# EasyEDA Pro project MIC01.eprj

# Schematic 主控板
Board Name: 主控; Create Date: 2024-11-15; Page Name: P1; Project Name: MIC01; Schematic Name: Schematic1; Update Date: 2024-11-18; Company: 嘉立创EDA; Page Size: A4; Version: V1.0
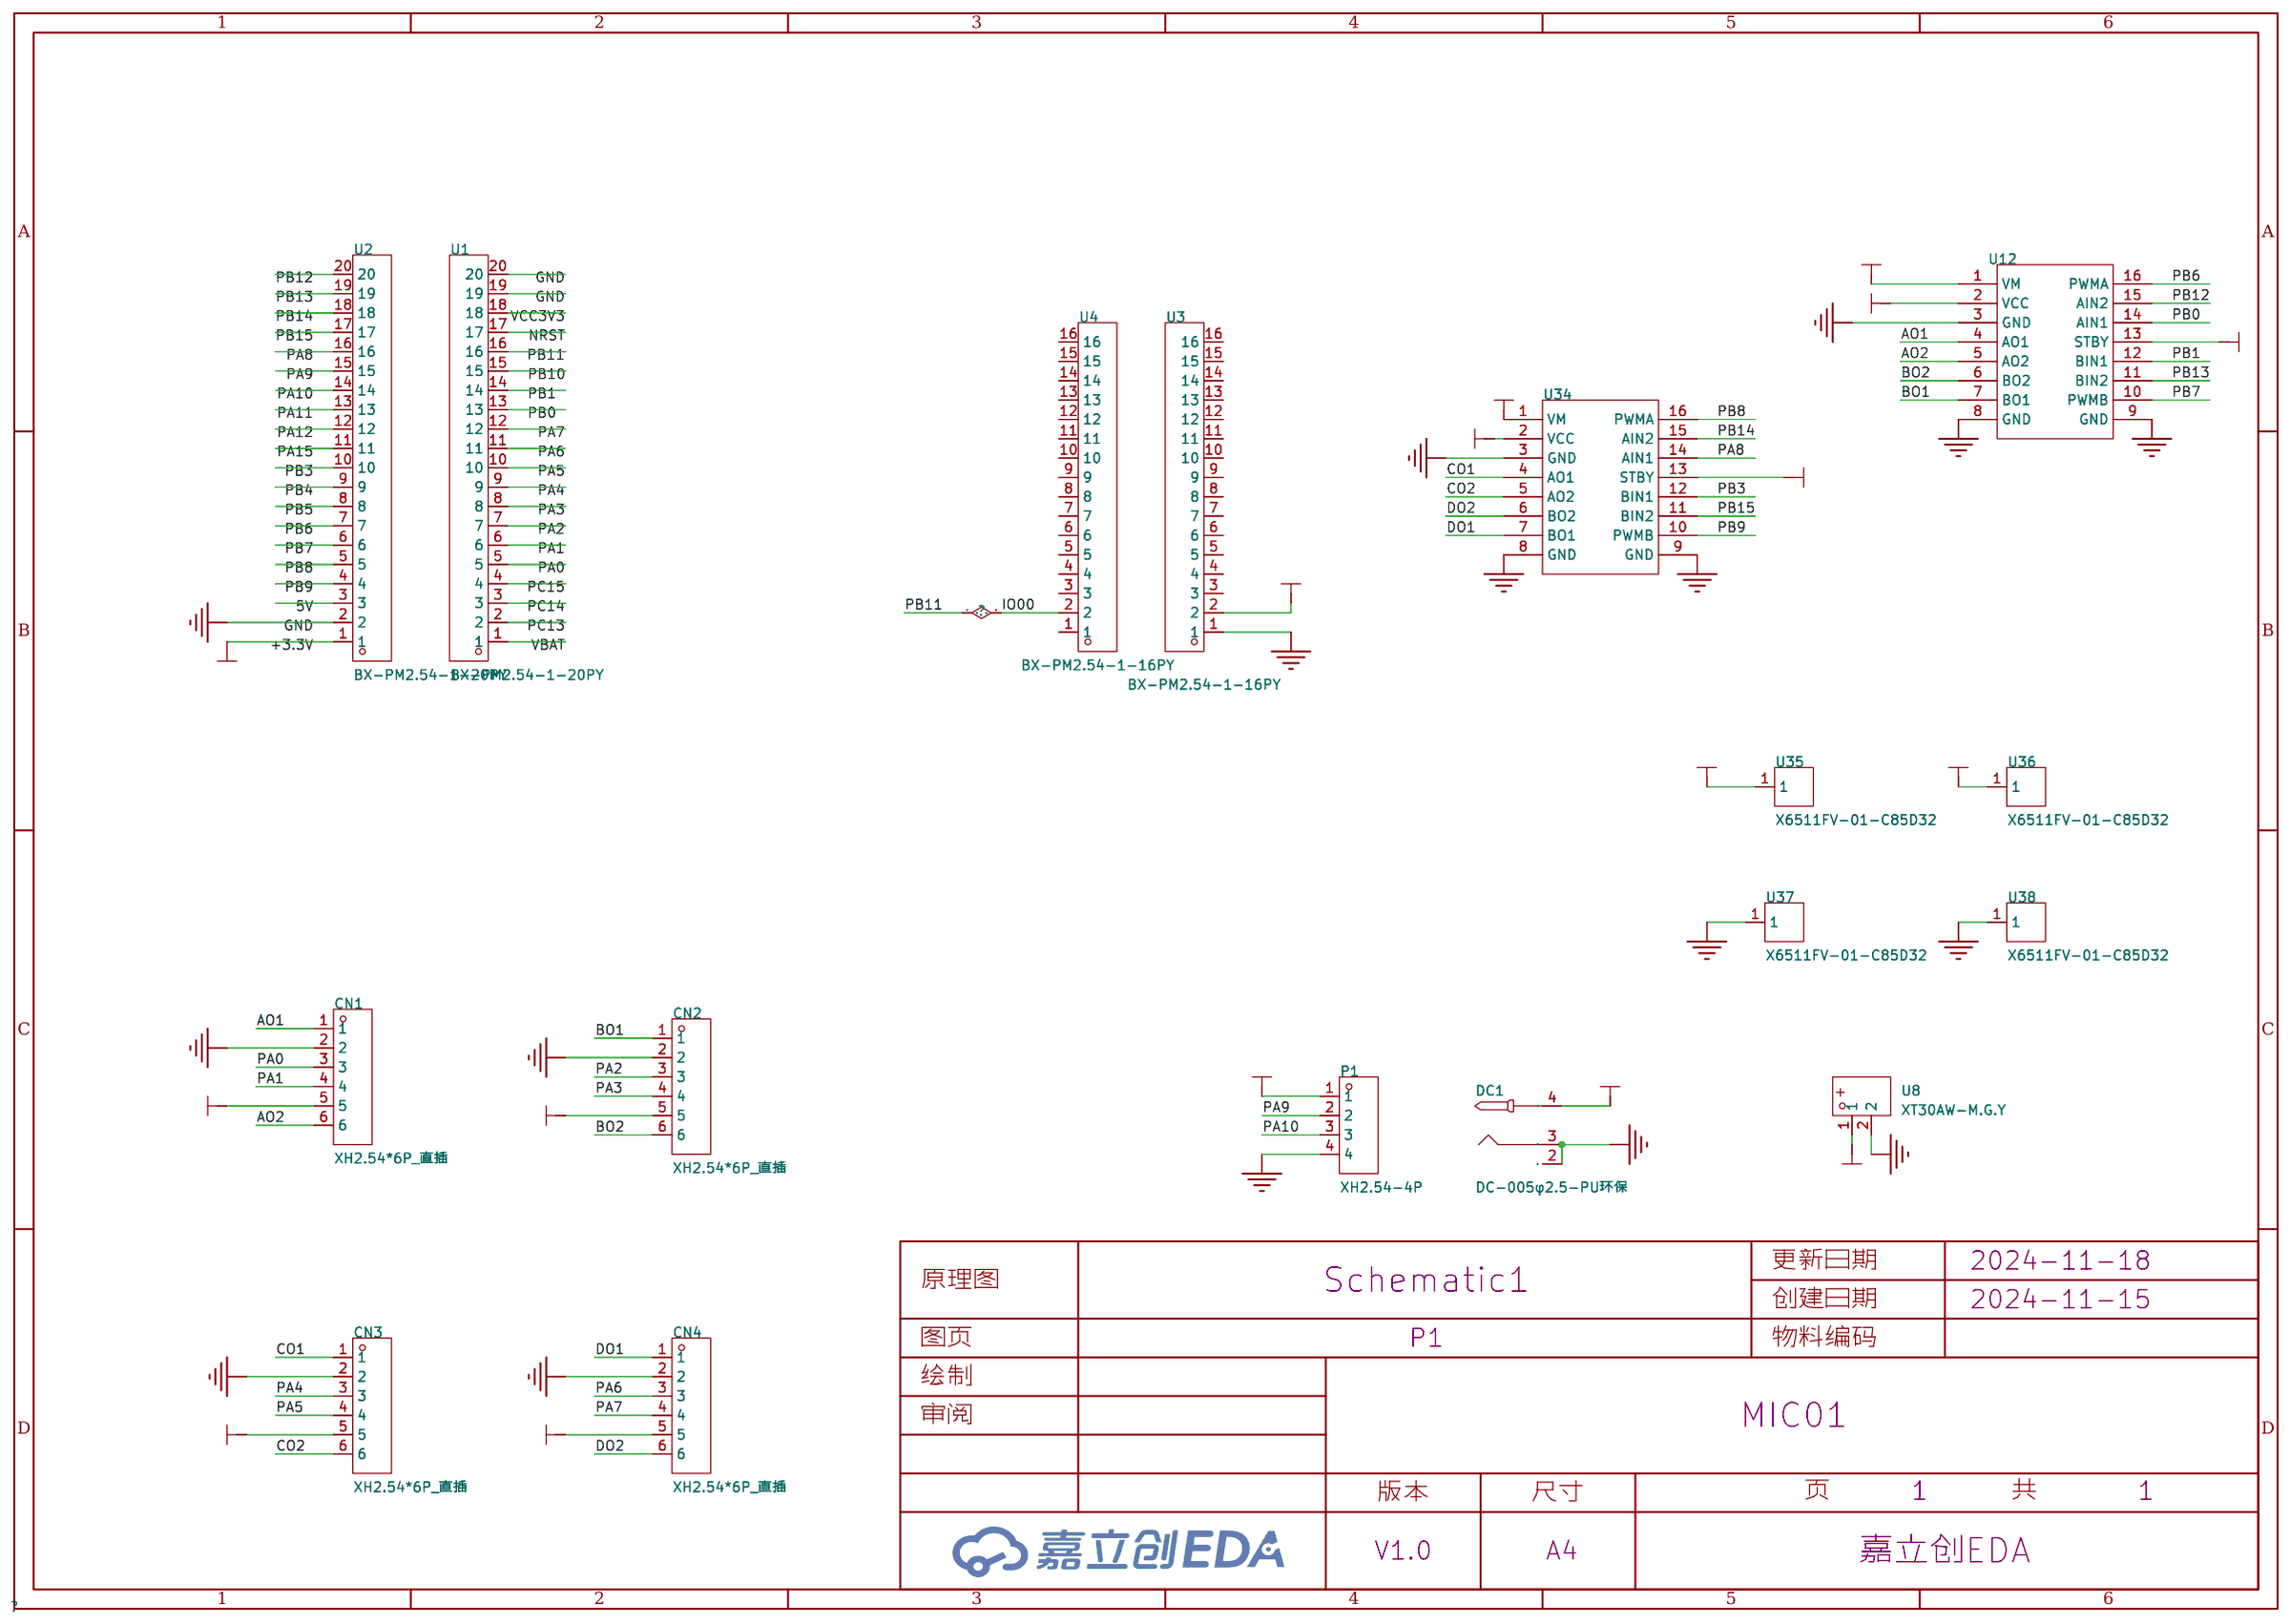
[diagram p0: schematic sheet]

## Parts
CN1  XH2.54*6P_直插  [CONN-TH_XH2.54-6P]
CN2  XH2.54*6P_直插  [CONN-TH_XH2.54-6P]
CN3  XH2.54*6P_直插  [CONN-TH_XH2.54-6P]
CN4  XH2.54*6P_直插  [CONN-TH_XH2.54-6P]
DC1  DC-005φ2.5-PU环保  [DC-IN-TH_DC-005]
P1  XH2.54-4P  [CONN-TH_4P-P2.50-XH2.54-4P]
U1  BX-PM2.54-1-20PY  [HDR-TH_20P-P2.54-V-F]
U2  BX-PM2.54-1-20PY  [HDR-TH_20P-P2.54-V-F]
U3  BX-PM2.54-1-16PY  [HDR-TH_16P-P2.54-V-F-1]
U4  BX-PM2.54-1-16PY  [HDR-TH_16P-P2.54-V-F-1]
U8  XT30AW-M.G.Y  [CONN-TH_XT30AW-M.G.Y]
U12  -  [TB6612FNG Module - 8pin x 2]
U34  -  [TB6612FNG Module - 8pin x 2]
U35  X6511FV-01-C85D32  [HDR-TH_1P-P2.54-V-F]
U36  X6511FV-01-C85D32  [HDR-TH_1P-P2.54-V-F]
U37  X6511FV-01-C85D32  [HDR-TH_1P-P2.54-V-F]
U38  X6511FV-01-C85D32  [HDR-TH_1P-P2.54-V-F]

## Library data of the parts
CN1-CN4 = XH2.54*6P_直插: Supplier Part: C9900008614; Supplier Footprint: XH2.54_6P; JLCPCB Part Class: 扩展库; Supplier: LCSC
DC1 = DC-005φ2.5-PU环保: LCSC Part Name: DC电源插座; Supplier Part: C2851165; Manufacturer: HOOYA(皓宇电子); Supplier Footprint: 插件; JLCPCB Part Class: 扩展库; Datasheet: https://atta.szlcsc.com/upload/public/pdf/source/20220630/47E893462D9446B3165C71C943EB39F4.pdf; Supplier: LCSC
P1 = XH2.54-4P_C9900003326: Supplier Part: C9900003326; JLCPCB Part Class: 扩展库; Supplier: LCSC
U1 U2 = BX-PM2.54-1-20PY: LCSC Part Name: 1x20P 间距:2.54mm 直插; Supplier Part: C18078139; Manufacturer: Bossie(博锡); Supplier Footprint: 插件,P=2.54mm; JLCPCB Part Class: 扩展库; Datasheet: https://atta.szlcsc.com/upload/public/pdf/source/20231017/32E63F46F3B3B896622B59D6A897F8B4.pdf; Supplier: LCSC; Holes Structure: 1x20P; Pitch: 2.54mm; Circular Hole / Square Hole: 方孔; Mounting Type: 直插; Number of Rows: 单排; Number of Holes: 20P; Voltage Rating (Max): 1kV; Holes Direction: 顶部; Insulation Height: 8.5mm; Contact Plating: 金; Operating Temperature Range: -40℃~+105℃; Soldering Temperature(Max): 260℃@5S
U3 U4 = BX-PM2.54-1-16PY: LCSC Part Name: 1x16P 间距:2.54mm 直插; Supplier Part: C18078137; Manufacturer: Bossie(博锡); Supplier Footprint: 插件,P=2.54mm; JLCPCB Part Class: 扩展库; Datasheet: https://atta.szlcsc.com/upload/public/pdf/source/20231017/241414C0D88EC9955029AE45684D38D5.pdf; Supplier: LCSC; Holes Structure: 1x16P; Pitch: 2.54mm; Circular Hole / Square Hole: 方孔; Mounting Type: 直插; Number of Rows: 单排; Number of Holes: 16P; Voltage Rating (Max): 1kV; Holes Direction: 顶部; Insulation Height: 8.5mm; Contact Plating: 金; Operating Temperature Range: -40℃~+105℃; Soldering Temperature(Max): 260℃@5S
U8 = XT30AW-M.G.Y: LCSC Part Name: XT30AW防水锁扣镀金15A二芯公插头; Supplier Part: C19268026; Manufacturer: AMASS(艾迈斯); JLCPCB Part Class: 扩展库; Datasheet: https://atta.szlcsc.com/upload/public/pdf/source/20231221/C234D60309612BC9E76FC24FD9732617.pdf; Supplier: LCSC
U12 U34 = TB6612FNG模块: Pin Type: In
U35-U38 = X6511FV-01-C85D32: LCSC Part Name: 间距:2.54mm 1x1P 直插; Supplier Part: C2883837; Manufacturer: XKB Connectivity(中国星坤); Supplier Footprint: 插件,P=2.54mm; JLCPCB Part Class: 扩展库; Datasheet: https://atta.szlcsc.com/upload/public/pdf/source/20211009/E31A179D77B4765F9C2936200B697B47.pdf; Supplier: LCSC; Holes Structure: 1x1P; Pitch: 2.54mm; Circular Hole / Square Hole: 方孔; Mounting Type: 直插; Number of Rows: 单排; Number of Holes: 1P; Current Rating (Max): 3A; Voltage Rating (Max): 250V; Holes Direction: 顶部; Insulation Height: 8.5mm; Contact Material: 黄铜; Contact Plating: 金; Operating Temperature Range: -40℃~+105℃; Soldering Temperature(Max): 260℃

## Nets
5V: U2.3
+3.3V: CN1.5 CN2.5 CN3.5 CN4.5 P1.1 U2.1 U3.2 U12.2(VCC) U12.13(STBY) U34.2(VCC) U34.13(STBY) U36.1
+12V: DC1.4 U8.1 U12.1(VM) U34.1(VM) U35.1
GND: CN1.2 CN2.2 CN3.2 CN4.2 DC1.2 DC1.3 P1.4 U1.19 U1.20 U2.2 U3.1 U8.2 U12.3(GND) U12.8(GND) U12.9(GND) U34.3(GND) U34.8(GND) U34.9(GND) U37.1 U38.1
VBAT: U1.1
VCC3V3: U1.18
AO1: CN1.1 U12.4(AO1)
AO2: CN1.6 U12.5(AO2)
BO1: CN2.1 U12.7(BO1)
BO2: CN2.6 U12.6(BO2)
CO1: CN3.1 U34.4(AO1)
CO2: CN3.6 U34.5(AO2)
DO1: CN4.1 U34.7(BO1)
DO2: CN4.6 U34.6(BO2)
IO00: U1.16 U4.2
NRST: U1.17
PA0: CN1.3 U1.5
PA1: CN1.4 U1.6
PA2: CN2.3 U1.7
PA3: CN2.4 U1.8
PA4: CN3.3 U1.9
PA5: CN3.4 U1.10
PA6: CN4.3 U1.11
PA7: CN4.4 U1.12
PA8: U2.16 U34.14(AIN1)
PA9: P1.2 U2.15
PA10: P1.3 U2.14
PA11: U2.13
PA12: U2.12
PA15: U2.11
PB0: U1.13 U12.14(AIN1)
PB1: U1.14 U12.12(BIN1)
PB3: U2.10 U34.12(BIN1)
PB4: U2.9
PB5: U2.8
PB6: U2.7 U12.16(PWMA)
PB7: U2.6 U12.10(PWMB)
PB8: U2.5 U34.16(PWMA)
PB9: U2.4 U34.10(PWMB)
PB10: U1.15
PB12: U2.20 U12.15(AIN2)
PB13: U2.19 U12.11(BIN2)
PB14: U2.18 U34.15(AIN2)
PB15: U2.17 U34.11(BIN2)
PC13: U1.2
PC14: U1.3
PC15: U1.4

Not connected (* = marked no-connect by the designer): U3 3 4 5 6 7 8 9 10 11 12 13 14 15 16; U4 1 3 4 5 6 7 8 9 10 11 12 13 14 15 16

# Schematic 分电板
Board Name: Board1; Create Date: 2024-11-23; Page Name: P1; Project Name: MIC01; Schematic Name: Schematic3; Update Date: 2024-11-23; Company: 嘉立创EDA; Page Size: A4; Version: V1.0
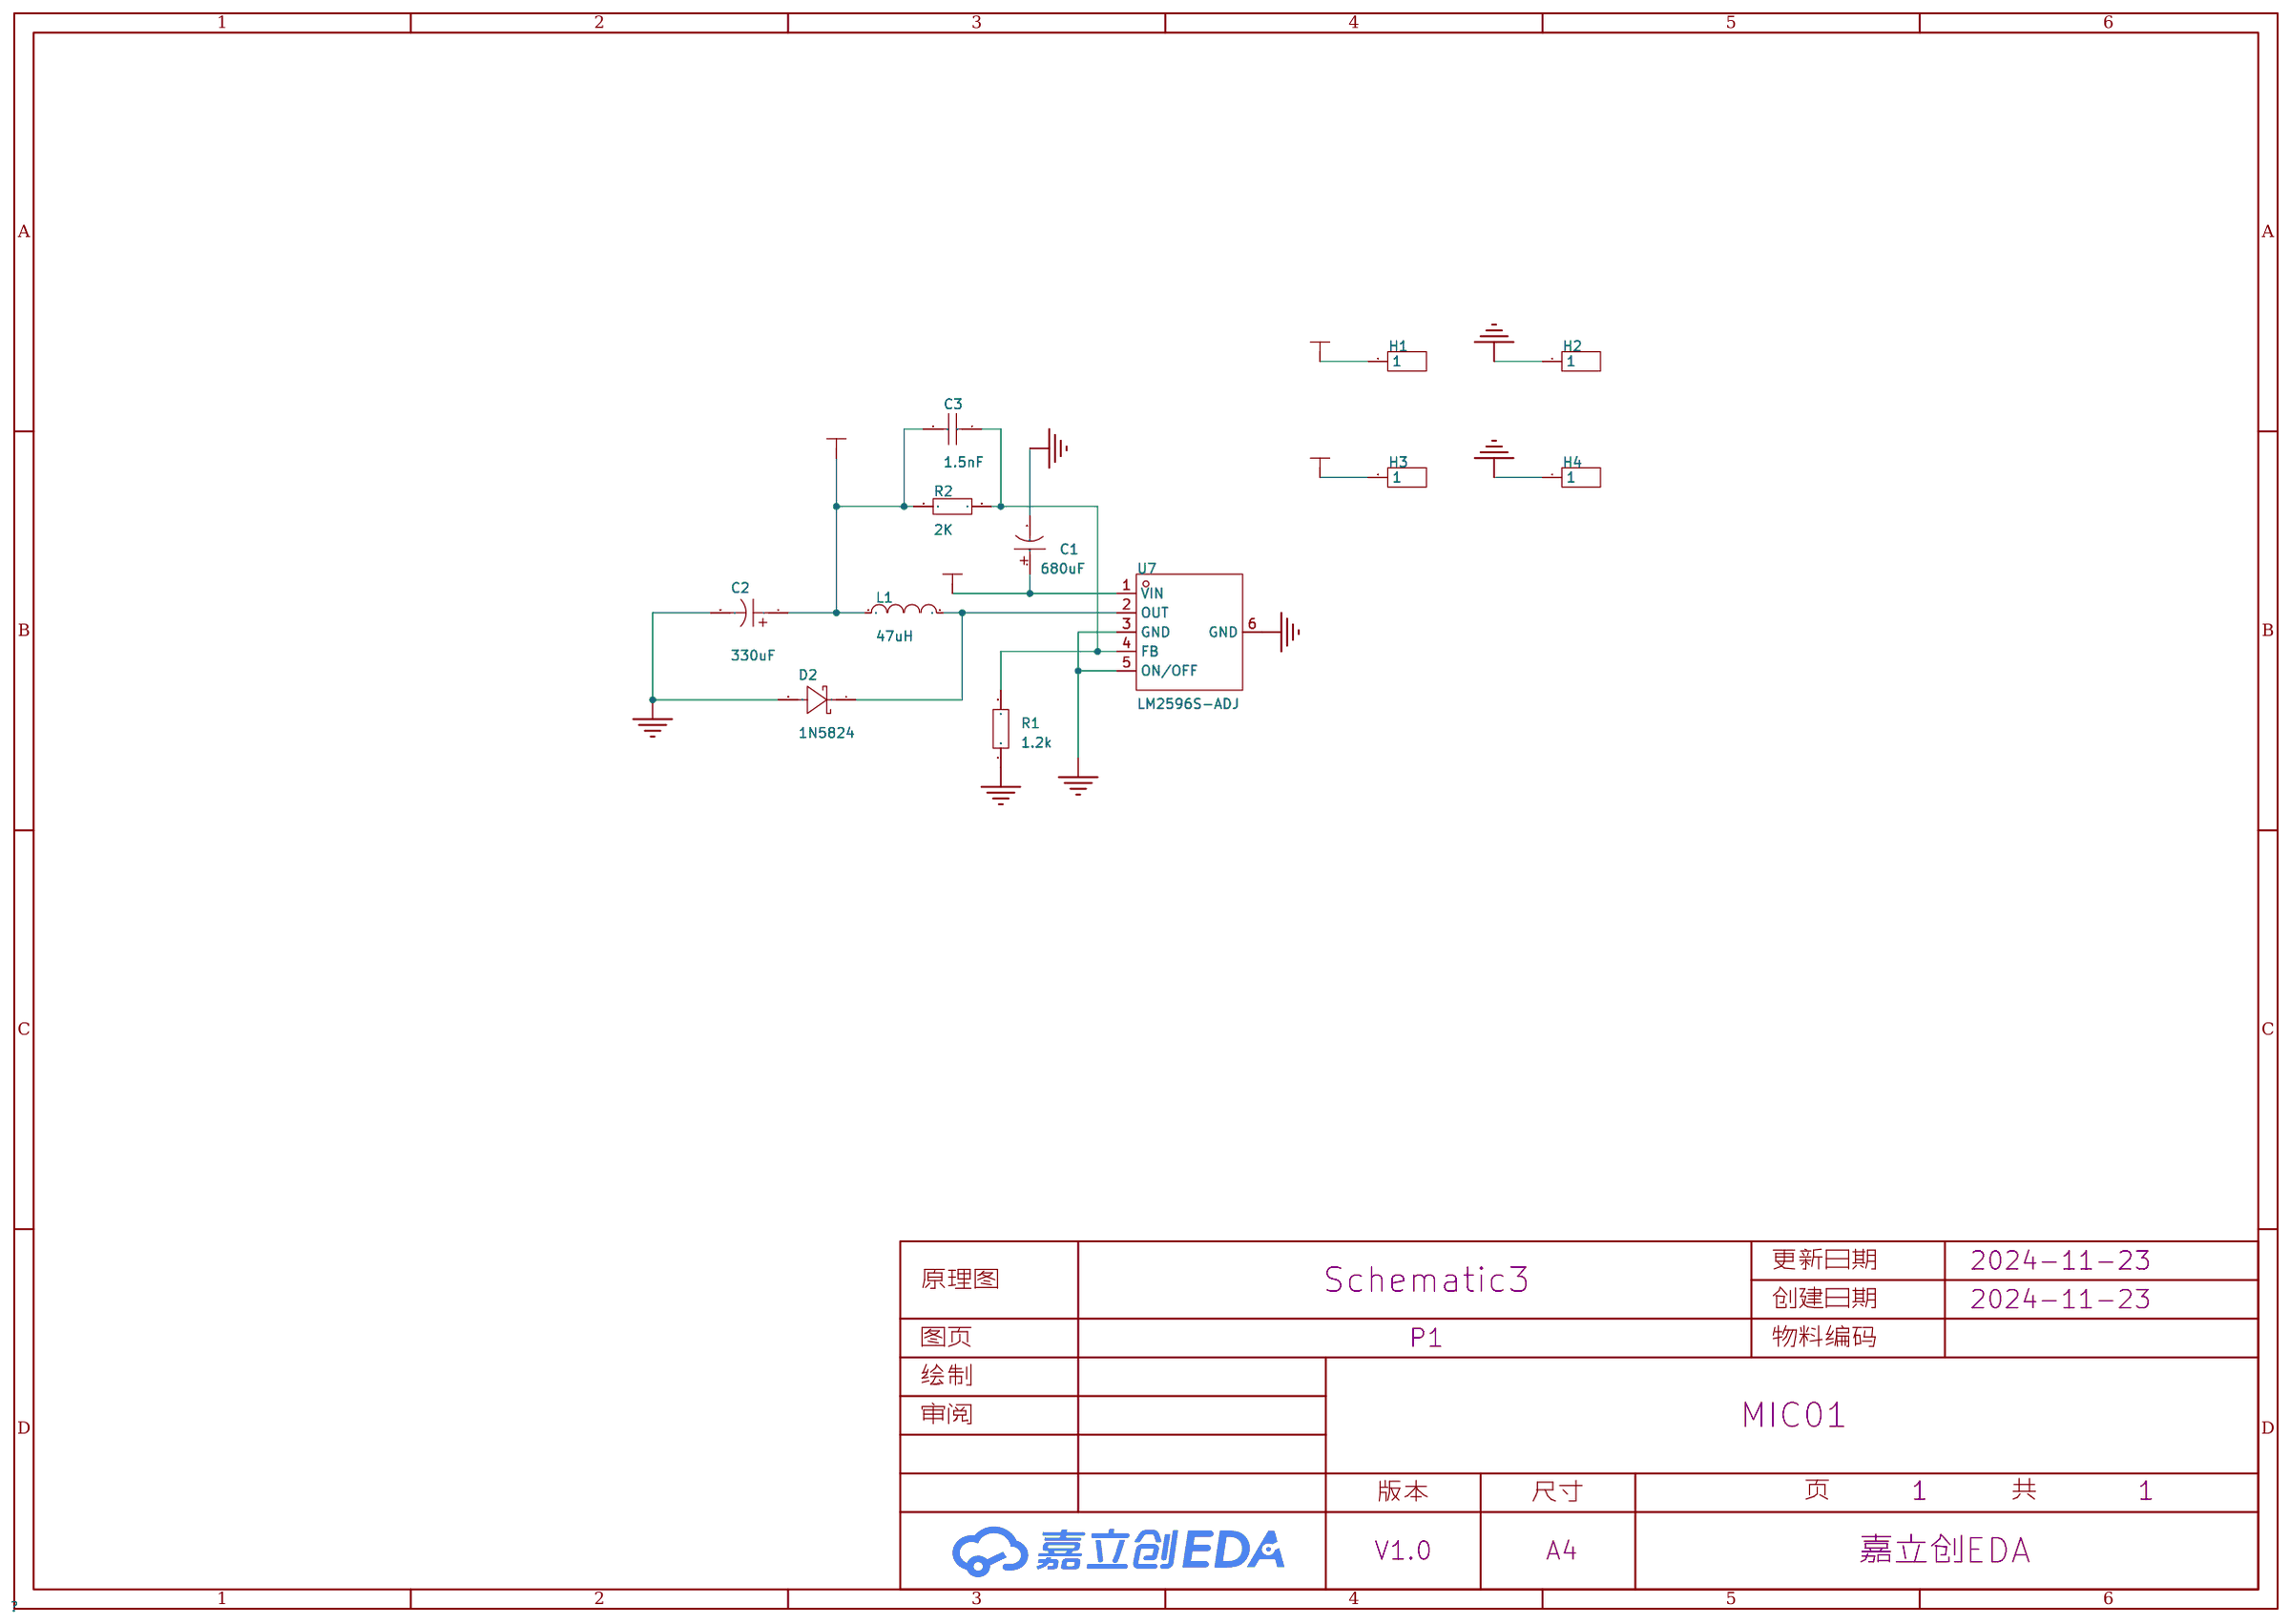
[diagram p1: schematic sheet]

## Parts
C1  680uF  [CAP-TH_BD12.5-P5.00-D0.6-FD]
C2  330uF  [CAP-SMD_BD6.3-L6.6-W6.6-LS7.6-RD]
C3  1.5nF  [C0603]
D2  1N5824  [DO-201AD_BD5.3-L9.0-P13.00-D1.3-RD]
H1  -  [HDR-TH_1P-V-M_XKB_X4611WV-01I-C28D40]
H2  -  [HDR-TH_1P-V-M_XKB_X4611WV-01I-C28D40]
H3  -  [HDR-TH_1P-V-M_XKB_X4611WV-01I-C28D40]
H4  -  [HDR-TH_1P-V-M_XKB_X4611WV-01I-C28D40]
L1  47uH  [IND-SMD_L11.5-W10.0_SMMS1040]
R1  1.2k  [R0603]
R2  2K  [R0603]
U7  LM2596S-ADJ  [TO-263-5_L10.0-W8.4-P1.70-LS15.3-BR]

## Library data of the parts
C1 = ERS1HM681W20OT: LCSC Part Name: 680uF ±20% 50V; Supplier Part: C106668; Manufacturer: AISHI(艾华集团); Supplier Footprint: 插件,D12.5xL20mm; JLCPCB Part Class: 扩展库; Datasheet: https://atta.szlcsc.com/upload/public/pdf/source/20191015/C438940_4B8E60A742BB0AE40DDEF87A5C89089D.pdf; Supplier: LCSC; Tolerance: ±20%; Rated Voltage: 50V; Lead Spacing: 5mm; φD: 12.5mm; L: 20mm; Lifetime @ Temp: 10000hrs@105℃
C2 = 189RV0016: LCSC Part Name: 330uF ±20% 25V; Supplier Part: C7471878; Manufacturer: KNSCHA(科尼盛); Supplier Footprint: SMD,D6.3xL7.7mm; JLCPCB Part Class: 扩展库; Datasheet: https://atta.szlcsc.com/upload/public/pdf/source/20230907/2CC9998DCC3B13BC64F25A423CB41A58.pdf; Supplier: LCSC; Tolerance: ±20%; Rated Voltage: 25V; Ripple Current: 600mA@100KHz; Equivalent Series Resistance(ESR): 160mΩ@100KHz; φD: 6.3mm; L: 7.7mm; Lifetime @ Temp: 2000hrs@105℃; Operating Temperature: -55℃~+105℃
C3 = 0603B152K500NT: LCSC Part Name: 1.5nF ±10% 50V; Supplier Part: C1595; Manufacturer: FH(风华); Supplier Footprint: 0603; JLCPCB Part Class: 扩展库; Datasheet: https://atta.szlcsc.com/upload/public/pdf/source/20200305/C486355_26A10D38EF8C2A5C37091D0039909270.pdf; Supplier: LCSC; Tolerance: ±10%; Voltage Rated: 50V; Temperature Coefficient: X7R
D2 = 1N5824_C27636124: Supplier Part: C27636124; Manufacturer: DOWO(东沃); Supplier Footprint: DO-201AD; JLCPCB Part Class: 扩展库; Datasheet: https://atta.szlcsc.com/upload/public/pdf/source/20240708/6850C5B8509EE8DDE8BCC0950A1E29E0.pdf; Supplier: LCSC
H1-H4 = HDR-M_2.54_1x1P: Supplier Part: C81276; Supplier Footprint: 插件; JLCPCB Part Class: Extended Part
L1 = SMMS1040-470M: LCSC Part Name: 47uH ±20% 4.5A; Supplier Part: C149599; Manufacturer: SXN(顺翔诺); JLCPCB Part Class: 扩展库; Datasheet: https://atta.szlcsc.com/upload/public/pdf/source/20210810/BBF24330FB2F5029F637830BA9C42C0D.pdf; Supplier: LCSC; Tolerance: ±20%; Rated Current: 3A; Saturation Current (Isat): 4.5A; DC Resistance (DCR): 155mΩ; Type: 一体成型电感
R1 R2 = Res_0603: Supplier Footprint: 0603
U7 = LM2596S-ADJ_C5349987: Supplier Part: C5349987; Manufacturer: HXY MOSFET(华轩阳电子); Supplier Footprint: TO-263-5L; JLCPCB Part Class: 扩展库; Datasheet: https://atta.szlcsc.com/upload/public/pdf/source/20230111/199BC35A7A4D0647B85E7DE5CE9FEA7F.pdf; Supplier: LCSC; Function: 降压型; Output Type: 可调; Input Voltage: 40V; Output Voltage: 1.23V~37V; Output Current (Max): 3.5A; Operating Temperature: -40℃~+125℃; Number of Outputs: 1; Switch tube (built-in/external): 内置

## Nets
+3.3V: C2.1 C3.1 H3.1 L1.1 R2.1
+12V: C1.1 H1.1 U7.1(VIN)
GND: C1.2 C2.2 D2.2(A) H2.1 H4.1 R1.1 U7.3(GND) U7.5(ON/OFF) U7.6(GND)
$1N450: D2.1(K) L1.2 U7.2(OUT)
$1N573: C3.2 R1.2 R2.2 U7.4(FB)

# Board PCB1
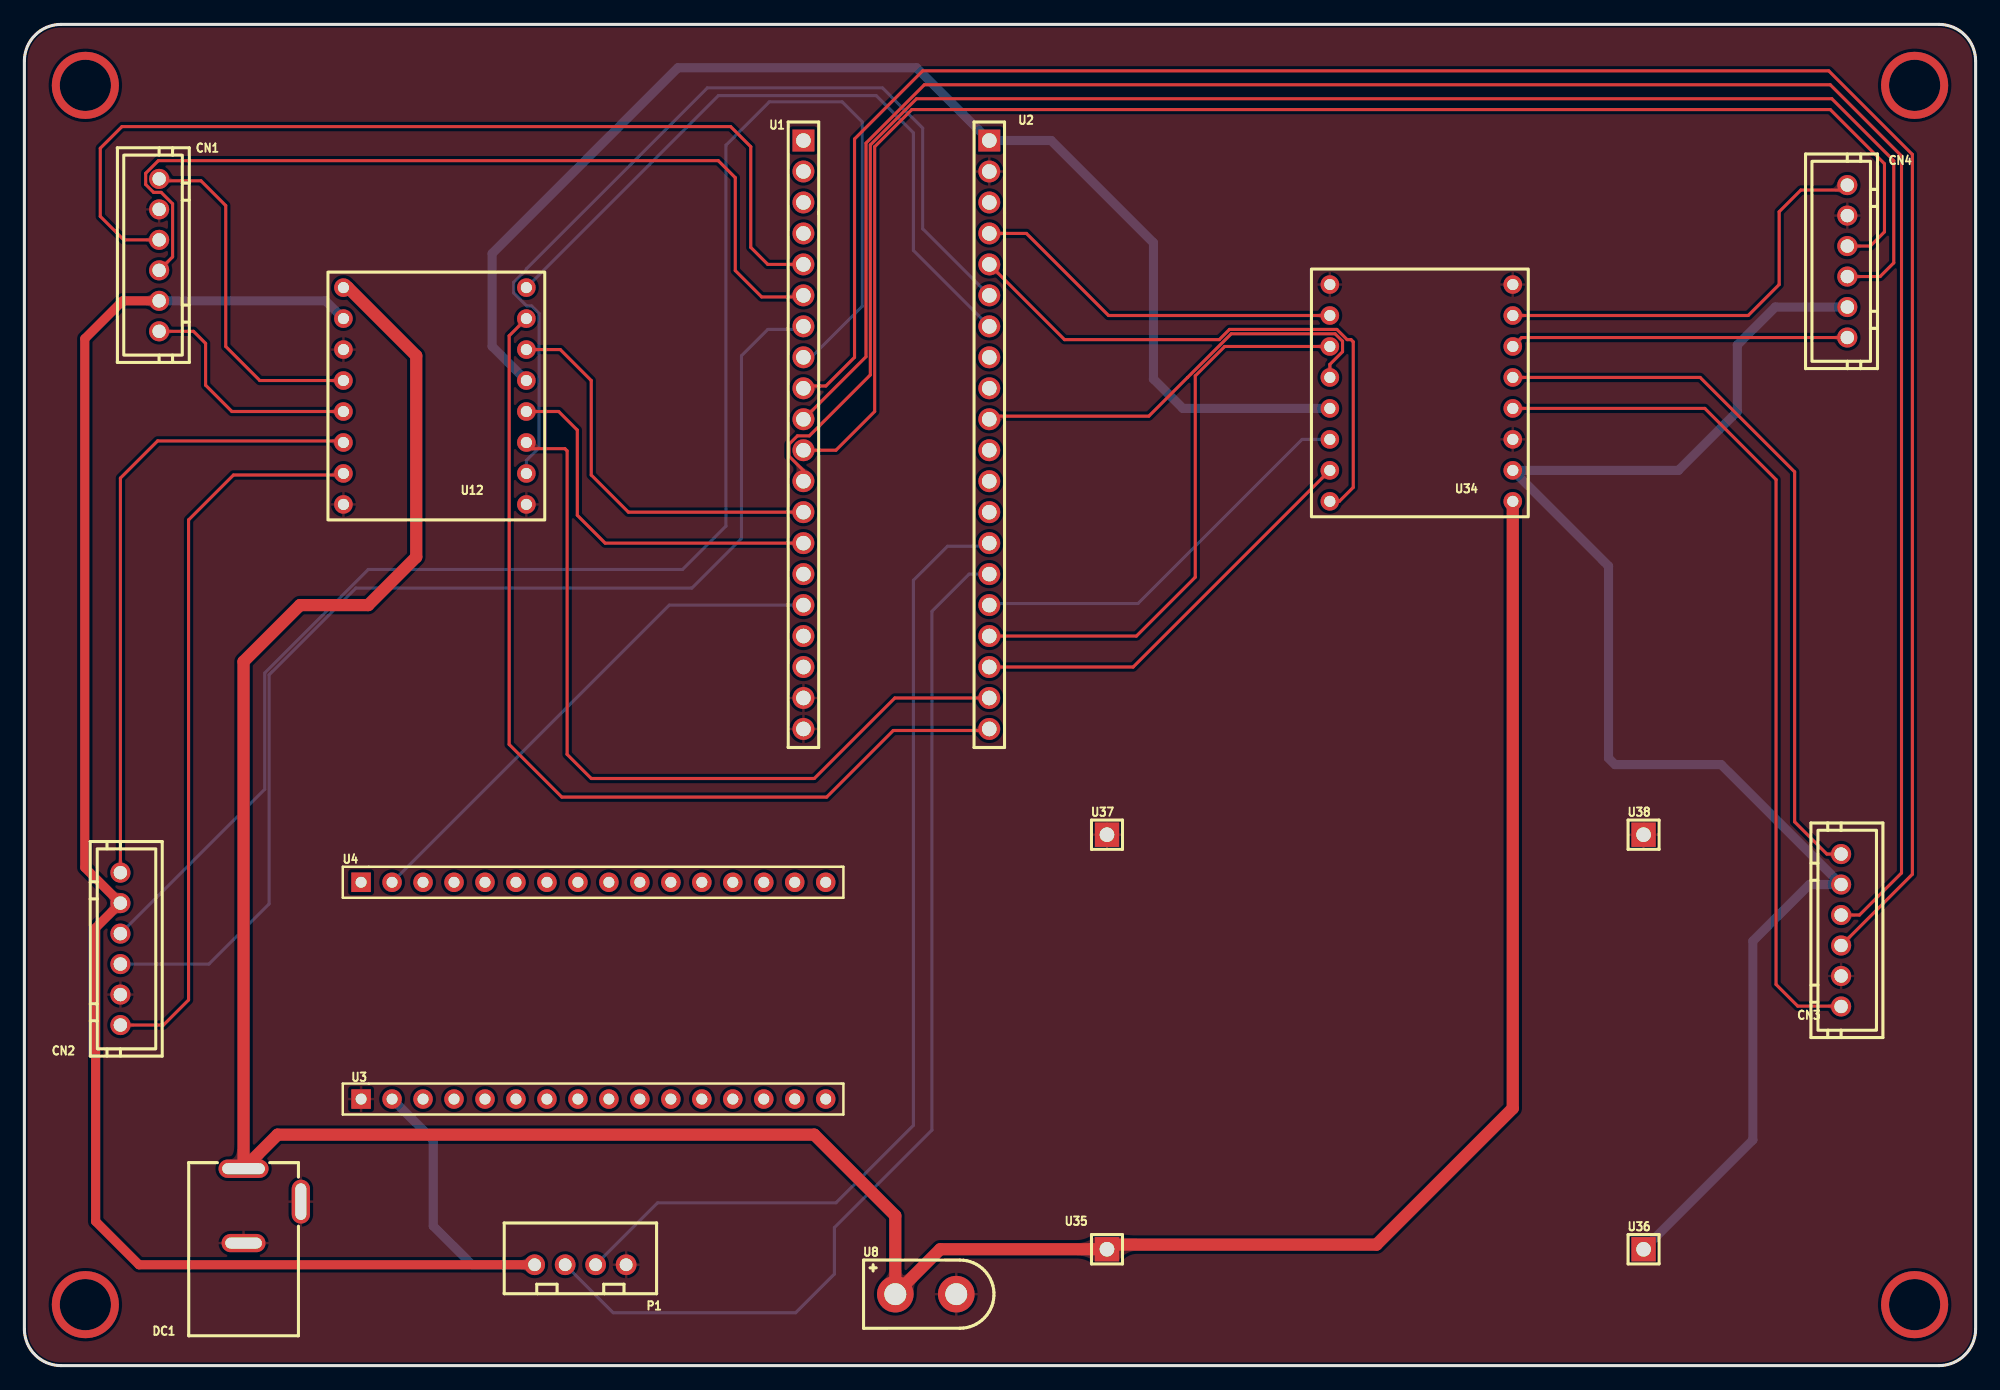
[diagram p2: board, top side]
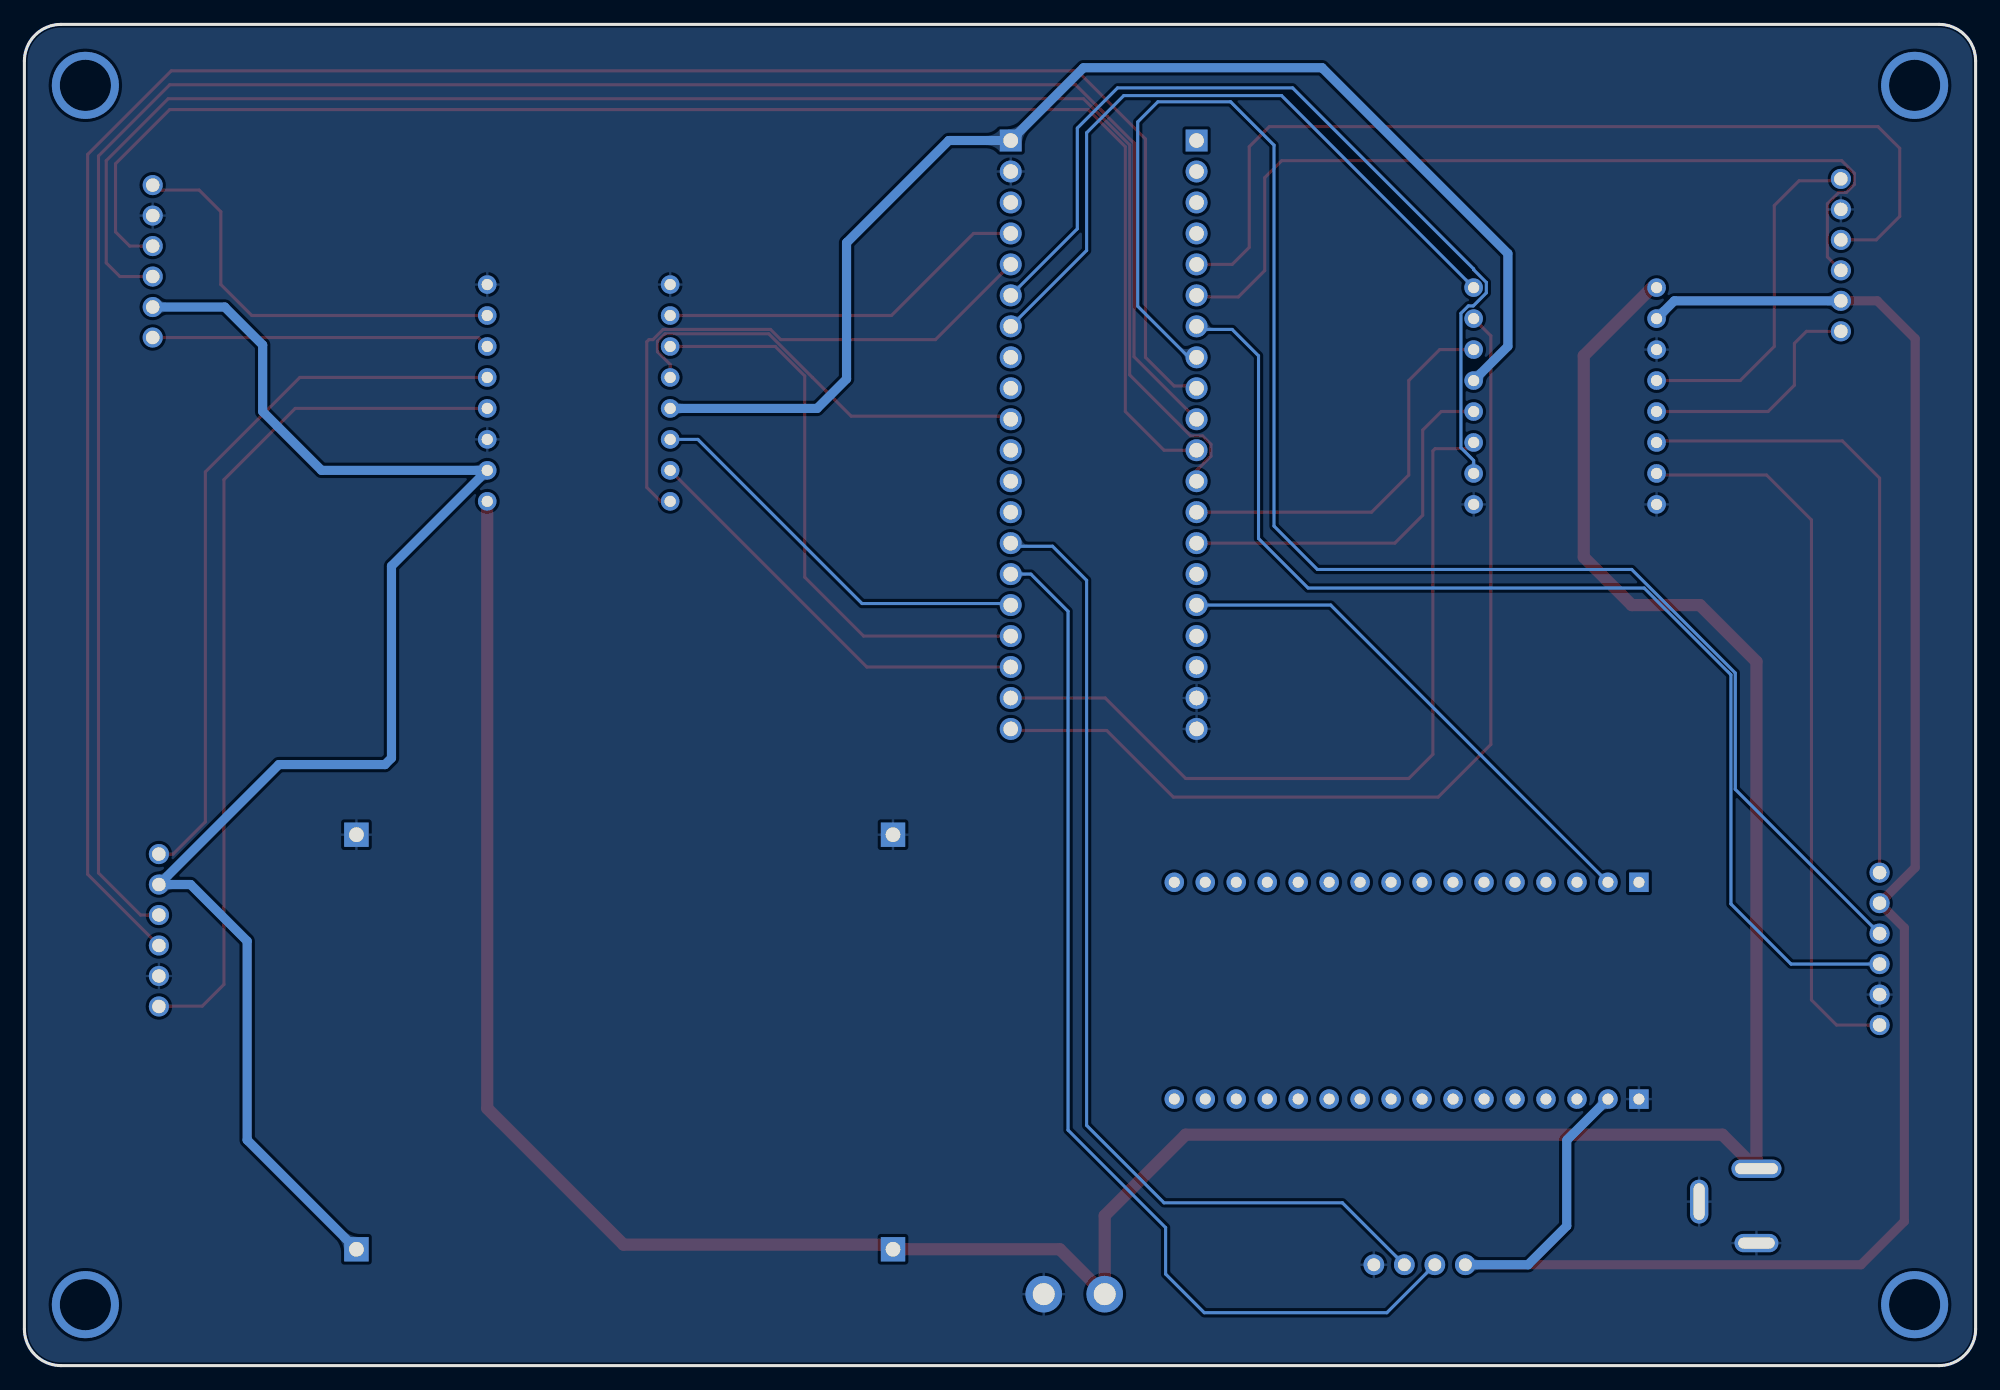
[diagram p3: board, bottom side, seen from below]

Outline 160 x 110 mm; copper layers: Top Layer, Bottom Layer. Coordinates in mm from the lower left corner of the outline.
Outline path: 0,107 0,3 arc(0.88,0.88) 3,0 157,0 arc(159.12,0.88) 160,3 160,107 arc(159.12,109.12) 157,110 3,110 arc(0.88,109.12) 0,107
Stack: Top Layer 0.035mm / Dielectric1 1.51mm FR4 er 4.5 / Bottom Layer 0.035mm

## Design rules (mm)
template: JLCPCB Capability(Two Layers Board)
spacing copperThickness1oz (default): track to track 0.102, other pairs 0.152 to 0.3
spacing copperThickness2oz: track to track 0.203, other pairs 0.152 to 0.3
track width copperThickness1oz (default): min 0.127, default 0.254, max 2.54
track width copperThickness2oz: min 0.203, default 0.254, max 2.54
differential pair differentialPair (default): width min 0.127, default 0.254, max 2.54; gap min 0.152, default 0.152
via viaSize (default): diameter min 0.5, default 0.61, max 10; hole min 0.3, default 0.305, max 6.3

## Placement (name value [footprint] x y rotation side)
CN1  XH2.54*6P_直插  [CONN-TH_XH2.54-6P]  11.05 91.08 270 top
CN2  XH2.54*6P_直插  [CONN-TH_XH2.54-6P]  7.87 34.18 90 top
CN3  XH2.54*6P_直插  [CONN-TH_XH2.54-6P]  148.97 35.7 90 top
CN4  XH2.54*6P_直插  [CONN-TH_XH2.54-6P]  149.48 90.57 270 top
DC1  DC-005φ2.5-PU环保  [DC-IN-TH_DC-005]  20.32 13.1 90 top
P1  XH2.54-4P  [CONN-TH_4P-P2.50-XH2.54-4P]  45.59 8.27 180 top
U1  BX-PM2.54-1-20PY  [HDR-TH_20P-P2.54-V-F]  63.88 76.34 270 top
U2  BX-PM2.54-1-20PY  [HDR-TH_20P-P2.54-V-F]  79.12 76.34 270 top
U3  BX-PM2.54-1-16PY  [HDR-TH_16P-P2.54-V-F-1]  46.66 21.86 0 top
U4  BX-PM2.54-1-16PY  [HDR-TH_16P-P2.54-V-F-1]  46.66 39.64 0 top
U8  XT30AW-M.G.Y  [CONN-TH_XT30AW-M.G.Y]  73.91 5.86 0 top
U12  -  [TB6612FNG Module - 8pin x 2]  33.78 79.52 0 top
U34  -  [TB6612FNG Module - 8pin x 2]  114.43 79.77 180 top
U35  X6511FV-01-C85D32  [HDR-TH_1P-P2.54-V-F]  88.77 9.54 0 top
U36  X6511FV-01-C85D32  [HDR-TH_1P-P2.54-V-F]  132.77 9.54 0 top
U37  X6511FV-01-C85D32  [HDR-TH_1P-P2.54-V-F]  88.77 43.54 0 top
U38  X6511FV-01-C85D32  [HDR-TH_1P-P2.54-V-F]  132.77 43.54 0 top

## Footprints (pads in the part's own frame, mm; a bottom-side part is the same pattern mirrored in y, then rotated)
CONN-TH_4P-P2.50-XH2.54-4P
  round 1.7 hole 1.05: 1(3.75,0) 2(1.25,0) 3(-1.25,0) 4(-3.75,0)
CONN-TH_XH2.54-6P
  round 1.65 hole 1.1: 1(-6.25,0) 2(-3.75,0) 3(-1.25,0) 4(1.25,0) 5(3.75,0) 6(6.25,0)
CONN-TH_XT30AW-M.G.Y
  round 3 hole 1.8: 1(-2.5,0) 2(2.5,0)
DC-IN-TH_DC-005
  oval 3.6x1.5 hole 3x0.9: 2(0.35,-2.35)
  oval 1.5x3.6 hole 0.9x3: 3(-3.05,2.35)
  oval 1.5x4.1 hole 0.9x3.5: 4(3.05,2.349)
HDR-TH_1P-P2.54-V-F
  rect 2x2 hole 1.2: 1(0,0)
HDR-TH_16P-P2.54-V-F-1
  rect 1.6x1.6 hole 0.9: 1(-19.05,0)
  round 1.6 hole 0.9: 2(-16.51,0) 3(-13.97,0) 4(-11.43,0) 5(-8.89,0) 6(-6.35,0) 7(-3.81,0) 8(-1.27,0) 9(1.27,0) 10(3.81,0) 11(6.35,0) 12(8.89,0) 13(11.43,0) 14(13.97,0) 15(16.51,0) 16(19.05,0)
HDR-TH_20P-P2.54-V-F
  rect 1.8x1.8 hole 1.2: 1(-24.13,0)
  round 1.8 hole 1.2: 2(-21.59,0) 3(-19.05,0) 4(-16.51,0) 5(-13.97,0) 6(-11.43,0) 7(-8.89,0) 8(-6.35,0) 9(-3.81,0) 10(-1.27,0) 11(1.27,0) 12(3.81,0) 13(6.35,0) 14(8.89,0) 15(11.43,0) 16(13.97,0) 17(16.51,0) 18(19.05,0) 19(21.59,0) 20(24.13,0)
TB6612FNG Module - 8pin x 2
  round 1.524 hole 0.914: 1(-7.62,8.89) 2(-7.62,6.35) 3(-7.62,3.81) 4(-7.62,1.27) 5(-7.62,-1.27) 6(-7.62,-3.81) 7(-7.62,-6.35) 8(-7.62,-8.89) 9(7.38,-8.89) 10(7.38,-6.35) 11(7.38,-3.81) 12(7.38,-1.27) 13(7.38,1.27) 14(7.38,3.81) 15(7.38,6.35) 16(7.38,8.89)

## Nets
As in the schematic.

Pads without a net: U3 3 4 5 6 7 8 9 10 11 12 13 14 15 16; U4 1 3 4 5 6 7 8 9 10 11 12 13 14 15 16

## Via types
v1: diameter 5.5, hole 4.2, Top Layer to Bottom Layer, 4 vias

## Routing (per net, layer and track width the routed paths; a pad name or vN(x,y) marks a point on that pad's centre or on a via; arc(x,y) is an arc through that point)
+3.3V: length 385.7
  Top Layer w0.75: CN1.5 8.06,87.33 4.95,84.22 4.95,40.85 CN2.5 5.84,35.9 5.84,11.83 9.4,8.27 P1.1
  Bottom Layer w0.75: U3.2 33.53,18.48 33.53,11.45 36.7,8.27 P1.1 ; CN1.5 24.7,87.33 U12.2 ; U34.13 95,78.5 92.58,80.92 92.58,92.09 84.2,100.47 79.12,100.47 73.15,106.44 53.59,106.44 38.35,91.2 38.35,83.6 U12.13 ; U36.1 141.73,18.5 141.73,34.82 146.37,39.45 CN3.5 139.13,49.29 130.43,49.29 129.9,49.82 129.9,65.57 U34.2 135.64,73.42 140.46,78.25 140.46,83.71 143.57,86.82 CN4.5
+12V: length 254.6
  Top Layer w1: U12.1 26.54,88.41 32.13,82.82 32.13,66.31 28.19,62.38 22.61,62.38 17.97,57.74 DC1.4 20.76,18.94 64.77,18.94 71.41,12.3 U8.1 75.1,9.54 U35.1 89.15,9.92 110.87,9.92 122.05,21.1 U34.1
(no net):
  vias: v1(5,105) v1(5,5) v1(155,105) v1(155,5)
AO1: length 28.7
  Top Layer w0.254: CN1.1 11.2,97.17 14.48,97.17 16.51,95.14 16.51,83.58 19.3,80.79 U12.4
AO2: length 19.8
  Top Layer w0.254: U12.5 17.02,78.25 14.86,80.41 14.86,83.84 13.87,84.83 CN1.6
BO1: length 60.1
  Top Layer w0.254: U12.7 26.03,73.04 17.14,73.04 13.46,69.36 13.46,29.99 11.4,27.93 7.87,27.93
BO2: length 52
  Top Layer w0.254: U12.6 26.03,75.84 10.92,75.84 7.87,72.79 CN2.6
CO1: length 71.5
  Top Layer w0.254: 148.97,29.46 148.94,29.48 145.41,29.48 143.64,31.26 143.64,72.66 137.79,78.5 U34.4
CO2: length 59.9
  Top Layer w0.254: CN3.6 147.8,41.95 145.16,44.59 145.16,73.3 137.41,81.04 U34.5
DO1: length 35.4
  Top Layer w0.254: CN4.1 149.07,96.41 145.67,96.41 143.89,94.63 143.89,88.66 141.35,86.12 U34.7
DO2: length 27.7
  Top Layer w0.254: U34.6 122.78,84.32 CN4.6
IO00: length 43.1
  Bottom Layer w0.254: U1.16 52.88,62.38 U4.2
PA0: length 79.1
  Top Layer w0.254: CN1.3 8.15,92.33 6.22,94.25 6.22,99.84 8,101.62 57.91,101.62 59.56,99.97 59.56,91.71 60.96,90.31 U1.5
PA1: length 73.2
  Top Layer w0.254: CN1.4 12.15,90.93 12.15,95.28 11.21,96.22 10.59,96.22 9.94,96.87 9.94,97.78 10.98,98.82 56.9,98.82 58.29,97.43 58.29,89.81 60.45,87.65 63.75,87.65 U1.6
PA2: length 97.5
  Bottom Layer w0.254: U1.7 63.63,84.98 60.96,84.98 58.8,82.82 58.8,67.84 54.74,63.77 27.18,63.77 20.07,56.66 20.07,37.86 15.13,32.93 CN2.3
PA3: length 135.3
  Bottom Layer w0.254: CN2.4 19.71,47.27 19.71,56.81 28.2,65.3 53.97,65.3 57.53,68.85 57.53,100.09 61.09,103.65 67.06,103.65 68.71,102 68.71,86.89 64.52,82.69 U1.8
PA4: length 182.3
  Top Layer w0.254: CN3.3 154.81,40.3 154.81,99.33 147.96,106.19 73.66,106.19 68.07,100.6 68.07,82.69 65.72,80.35 64.07,80.35 U1.9
PA5: length 179.3
  Top Layer w0.254: U1.10 69.01,82.75 69.01,100.26 73.8,105.05 148.08,105.05 153.92,99.2 153.92,40.4 150.47,36.95 CN3.4
PA6: length 123.9
  Top Layer w0.254: U1.11 66.55,75.08 69.72,78.25 69.72,99.97 72.77,103.02 148.08,103.02 152.53,98.57 152.53,92.98 151.36,91.82 CN4.3
PA7: length 131.7
  Top Layer w0.254: CN4.4 152.17,89.32 153.29,90.44 153.29,98.82 148.21,103.9 73.16,103.9 69.37,100.11 69.37,81.25 64.37,76.25 63.39,76.25 62.7,75.56 62.7,74.59 63.88,73.41 U1.12
PA8: length 33.6
  Bottom Layer w0.254: U34.14 104.78,75.96 91.31,62.5 79.25,62.5 U2.16
PA9: length 88.7
  Bottom Layer w0.254: P1.2 48.28,4.34 63.25,4.34 66.42,7.51 66.42,11.32 74.42,19.32 74.42,61.87 77.47,64.92 79.12,64.92
PA10: length 83
  Bottom Layer w0.254: U2.14 78.87,67.2 75.69,67.2 72.9,64.41 72.9,19.7 66.55,13.35 51.92,13.35 P1.3
PB0: length 32.8
  Top Layer w0.254: U12.14 43.94,83.33 46.48,80.79 46.48,73.04 49.53,70 U1.13
PB1: length 31.3
  Top Layer w0.254: U12.12 43.81,78.25 45.34,76.73 45.34,69.74 47.62,67.45 U1.14
PB3: length 35.5
  Top Layer w0.254: U34.12 107.05,82.11 108.09,83.15 108.09,84.02 107.48,84.62 98.96,84.62 95.38,81.04 95.38,81.04 92.2,77.87 79.38,77.87 U2.10
PB6: length 58
  Bottom Layer w0.254: U12.16 56.91,104.16 69.85,104.16 72.9,101.11 72.9,91.46 U2.7
PB7: length 74.7
  Bottom Layer w0.254: U2.6 73.66,93.24 73.66,101.49 70.36,104.79 56.01,104.79 41.16,89.95 41.16,89.88 40.12,88.84 40.12,87.98 41.19,86.91 41.59,86.91 42.2,86.3 42.2,75.28 41.16,74.24 U12.10
PB8: length 47.5
  Top Layer w0.254: U2.5 85.29,84.14 97.98,84.14 98.81,84.98 107.63,84.98 108.46,84.14 108.79,84.14 108.97,83.97 108.97,72.03 107.82,70.88 U34.16
PB9: length 30.7
  Top Layer w0.254: U2.4 82.17,92.86 88.9,86.12 U34.10
PB12: length 79
  Top Layer w0.254: U2.20 78.99,52.09 71.25,52.09 65.79,46.63 44.07,46.63 39.75,50.94 39.75,84.46 U12.15
PB13: length 66.7
  Top Layer w0.254: U12.11 41.67,75.2 44.32,75.2 44.5,75.02 44.5,50.13 46.48,48.15 64.77,48.15 71.37,54.75 U2.19
PB14: length 34.6
  Top Layer w0.254: U2.18 90.92,57.3 U34.15
PB15: length 47.4
  Top Layer w0.254: U2.17 91.19,59.83 96.01,64.66 96.01,81.17 98.43,83.58 U34.11

## Copper pours and planes (outline as drawn; the poured copper is in the pictures)
GND on Top Layer: -18.54,123.08 180.47,123.08 180.47,-21.83 -18.54,-21.83
GND on Bottom Layer: -19.18,123.84 181.86,123.84 181.86,-21.83 -19.18,-21.83

Small or netless copper shapes (teardrops, artwork), in the pictures only: 57 on Top Layer, 28 on Bottom Layer

# Board PCB3
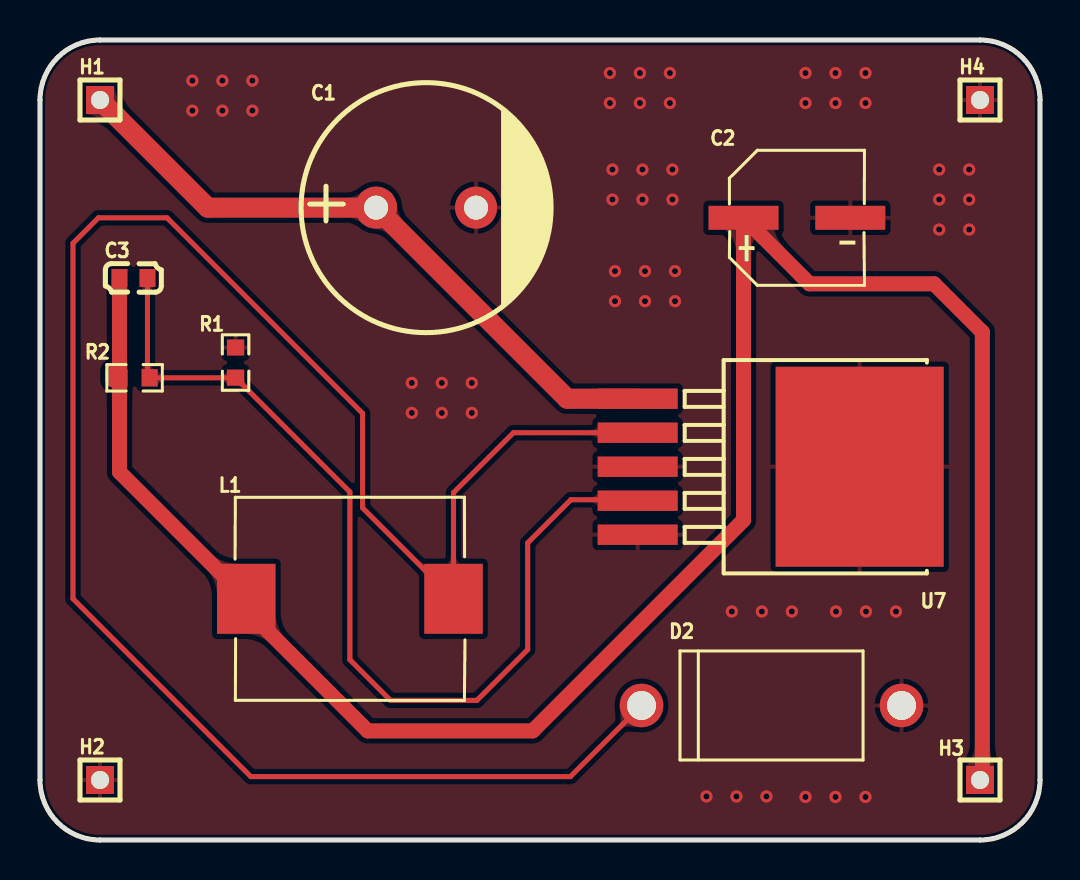
[diagram p4: board, top side]
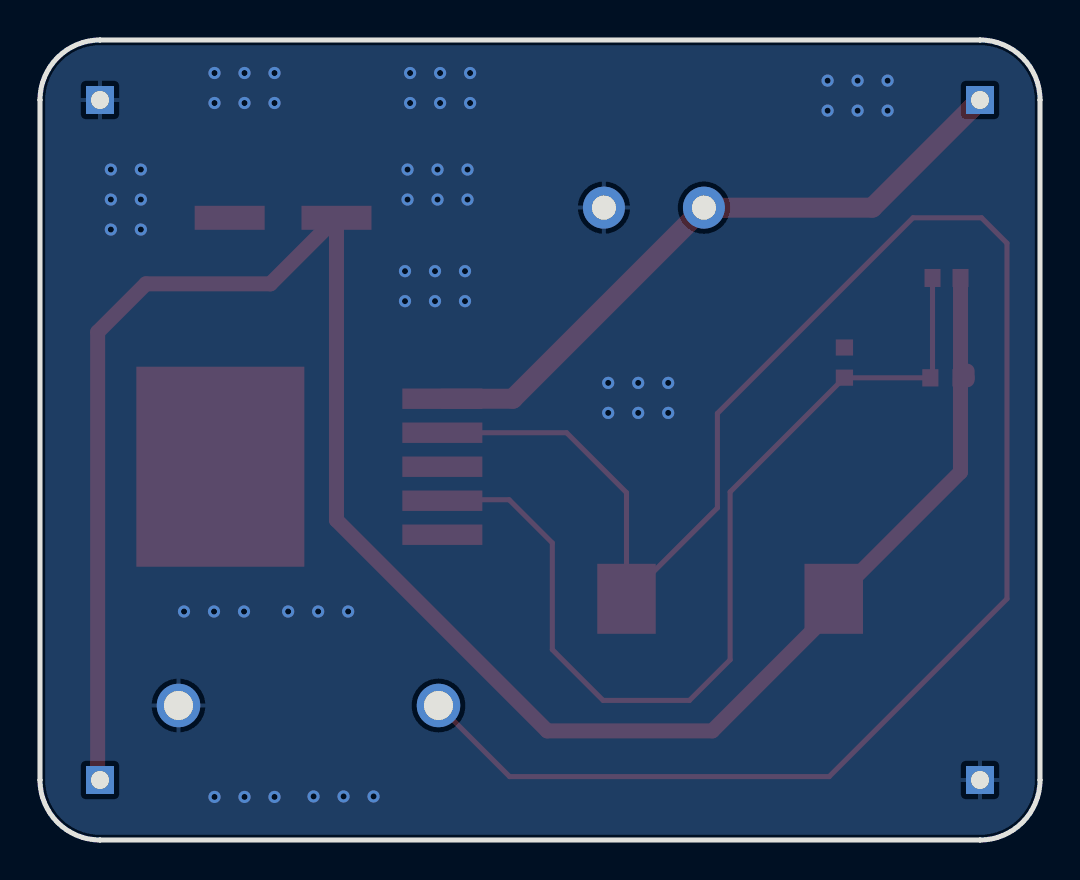
[diagram p5: board, bottom side, seen from below]

Outline 50 x 40 mm; copper layers: Top Layer, Bottom Layer. Coordinates in mm from the lower left corner of the outline.
Outline path: 0,37 0,3 arc(0.88,0.88) 3,0 47,0 arc(49.12,0.88) 50,3 50,37 arc(49.12,39.12) 47,40 3,40 arc(0.88,39.12) 0,37
Stack: Top Layer 0.035mm / Dielectric1 1.51mm FR4 er 4.5 / Bottom Layer 0.035mm

## Design rules (mm)
template: JLCPCB Capability(Two Layers Board)
spacing copperThickness1oz (default): track to track 0.102, other pairs 0.152 to 0.3
spacing copperThickness2oz: track to track 0.203, other pairs 0.152 to 0.3
track width copperThickness1oz (default): min 0.127, default 0.254, max 2.54
track width copperThickness2oz: min 0.203, default 0.254, max 2.54
differential pair differentialPair (default): width min 0.127, default 0.254, max 2.54; gap min 0.152, default 0.152
via viaSize (default): diameter min 0.5, default 0.61, max 10; hole min 0.3, default 0.305, max 6.3

## Placement (name value [footprint] x y rotation side)
C1  680uF  [CAP-TH_BD12.5-P5.00-D0.6-FD]  19.3 31.62 0 top
C2  330uF  [CAP-SMD_BD6.3-L6.6-W6.6-LS7.6-RD]  37.85 31.11 0 top
C3  1.5nF  [C0603]  4.67 28.1 0 top
D2  1N5824  [DO-201AD_BD5.3-L9.0-P13.00-D1.3-RD]  36.58 6.73 0 top
H1  -  [HDR-TH_1P-V-M_XKB_X4611WV-01I-C28D40]  3 37 0 top
H2  -  [HDR-TH_1P-V-M_XKB_X4611WV-01I-C28D40]  3 3 0 top
H3  -  [HDR-TH_1P-V-M_XKB_X4611WV-01I-C28D40]  47 3 0 top
H4  -  [HDR-TH_1P-V-M_XKB_X4611WV-01I-C28D40]  47 37 0 top
L1  47uH  [IND-SMD_L11.5-W10.0_SMMS1040]  15.49 12.06 0 top
R1  1.2k  [R0603]  9.78 23.87 270 top
R2  2K  [R0603]  4.73 23.11 0 top
U7  LM2596S-ADJ  [TO-263-5_L10.0-W8.4-P1.70-LS15.3-BR]  35.43 18.66 180 top

## Footprints (pads in the part's own frame, mm; a bottom-side part is the same pattern mirrored in y, then rotated)
C0603
  rect 0.8x0.9 smd: 1(-0.7,0) 2(0.7,0)
CAP-SMD_BD6.3-L6.6-W6.6-LS7.6-RD
  rect 3.5x1.2 smd: 1(-2.67,0) 2(2.67,0)
CAP-TH_BD12.5-P5.00-D0.6-FD
  round 2.1 hole 1.2: 1(-2.5,0) 2(2.5,0)
DO-201AD_BD5.3-L9.0-P13.00-D1.3-RD
  round 2.175 hole 1.45: 1(-6.5,0) 2(6.5,0)
HDR-TH_1P-V-M_XKB_X4611WV-01I-C28D40
  rect 1.4x1.4 hole 0.9: 1(0,0)
IND-SMD_L11.5-W10.0_SMMS1040
  rect 2.924x3.5 smd: 1(-5.181,0) 2(5.181,0)
R0603
  rect 0.806x0.864 smd: 1(-0.753,0) 2(0.753,0)
TO-263-5_L10.0-W8.4-P1.70-LS15.3-BR
  rect 4x1.02 smd: 1(5.55,-3.4) 2(5.55,-1.7) 3(5.55,0) 4(5.55,1.7) 5(5.55,3.4)
  rect 8.4x10 smd: 6(-5.55,0)

## Nets
As in the schematic.

## Via types
v1: diameter 0.61, hole 0.305, Top Layer to Bottom Layer, 54 vias

## Routing (per net, layer and track width the routed paths; a pad name or vN(x,y) marks a point on that pad's centre or on a via; arc(x,y) is an arc through that point)
+3.3V: length 103.2
  Top Layer w0.75: 3.64,23.01 3.64,23.44 ; C3.1 3.97,23.11 ; H3.1 47.12,3.12 47.12,25.39 44.7,27.81 38.48,27.81 C2.1 35.18,15.99 24.64,5.46 16.38,5.46 10.31,11.53 L1.1 3.98,18.4 R2.1
+12V: length 33.1
  Top Layer w1: 29.88,22.06 26.36,22.06 C1.1 8.38,31.62 H1.1
GND:
  vias: v1(7.62,37.97) v1(7.62,36.47) v1(9.12,37.97) v1(9.12,36.47) v1(10.62,37.97) v1(10.62,36.47) v1(18.59,22.86) v1(18.59,21.36) v1(20.09,22.86) v1(20.09,21.36) v1(21.59,22.86) v1(21.59,21.36) v1(28.5,38.35) v1(28.5,36.85) v1(28.62,33.52) v1(28.62,32.02) v1(28.75,28.44) v1(28.75,26.94) v1(30,38.35) v1(30,36.85) v1(30.12,33.52) v1(30.12,32.02) v1(30.25,28.44) v1(30.25,26.94) v1(31.5,38.35) v1(31.5,36.85) v1(31.62,33.52) v1(31.62,32.02) v1(31.75,28.44) v1(31.75,26.94) v1(33.32,2.18) v1(34.59,11.42) v1(34.82,2.18) v1(36.09,11.42) v1(36.32,2.18) v1(37.59,11.42) v1(38.28,38.35) v1(38.28,36.85) v1(38.28,2.15) v1(39.78,38.35) v1(39.78,36.85) v1(39.8,11.42) v1(39.78,2.15) v1(41.28,38.35) v1(41.28,36.85) v1(41.3,11.42) v1(41.28,2.15) v1(42.8,11.42) v1(44.96,33.52) v1(44.96,32.02) v1(44.96,30.52) v1(46.46,33.52) v1(46.46,32.02) v1(46.46,30.52)
$1N450: length 97.3
  Top Layer w0.254: 29.88,20.36 23.67,20.36 20.67,17.37 L1.2 16.13,16.61 16.13,21.33 6.35,31.11 2.92,31.11 1.65,29.84 1.65,12.06 10.54,3.17 26.52,3.17 D2.1
$1N573: length 48.3
  Top Layer w0.254: 29.88,16.96 29.83,17.01 26.54,17.01 24.38,14.85 24.38,9.52 21.84,6.98 17.53,6.98 15.49,9.01 15.49,17.4 R1.2 9.77,23.11 R2.2 5.37,23.22 C3.2

## Copper pours and planes (outline as drawn; the poured copper is in the pictures)
GND on Top Layer: -2.16,41.78 53.21,41.78 53.21,-2.67 -2.16,-2.67
GND on Bottom Layer: -2.41,42.16 52.83,42.16 52.83,-2.67 -2.41,-2.67

Small or netless copper shapes (teardrops, artwork), in the pictures only: 22 on Top Layer
